# Altium schematic sheet Sheet1.SchDoc
size A0; SheetNumber: 1; SheetTotal: 1
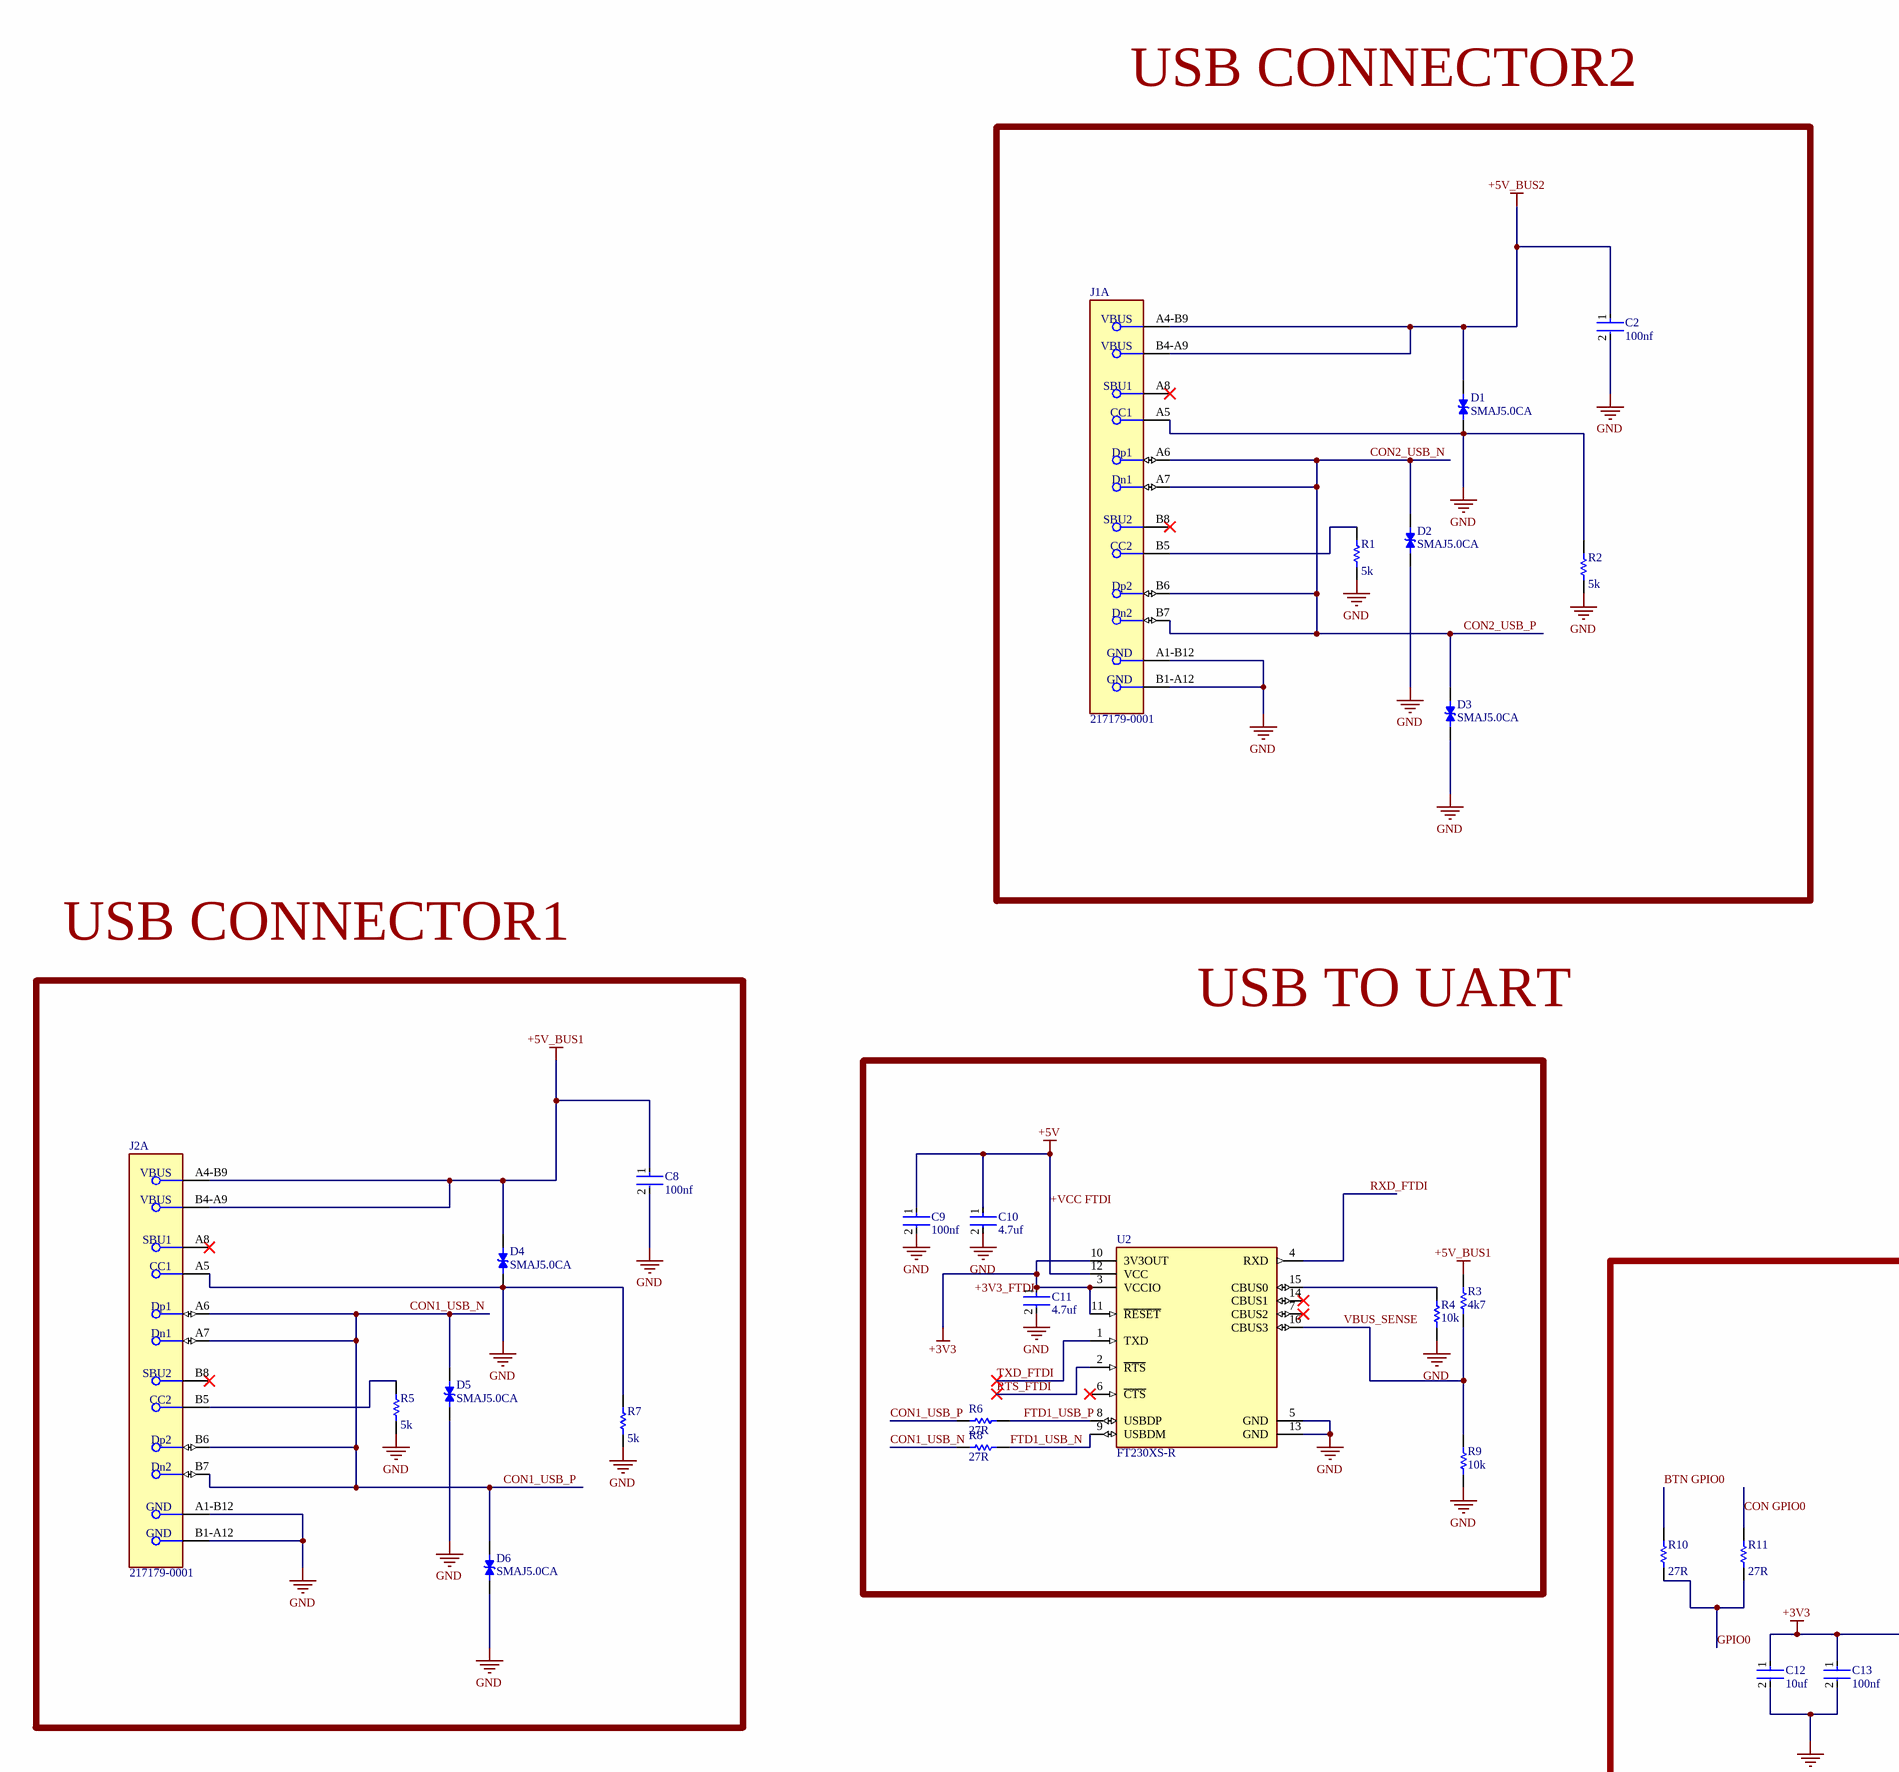
[diagram p0: Sheet1.SchDoc, top left]
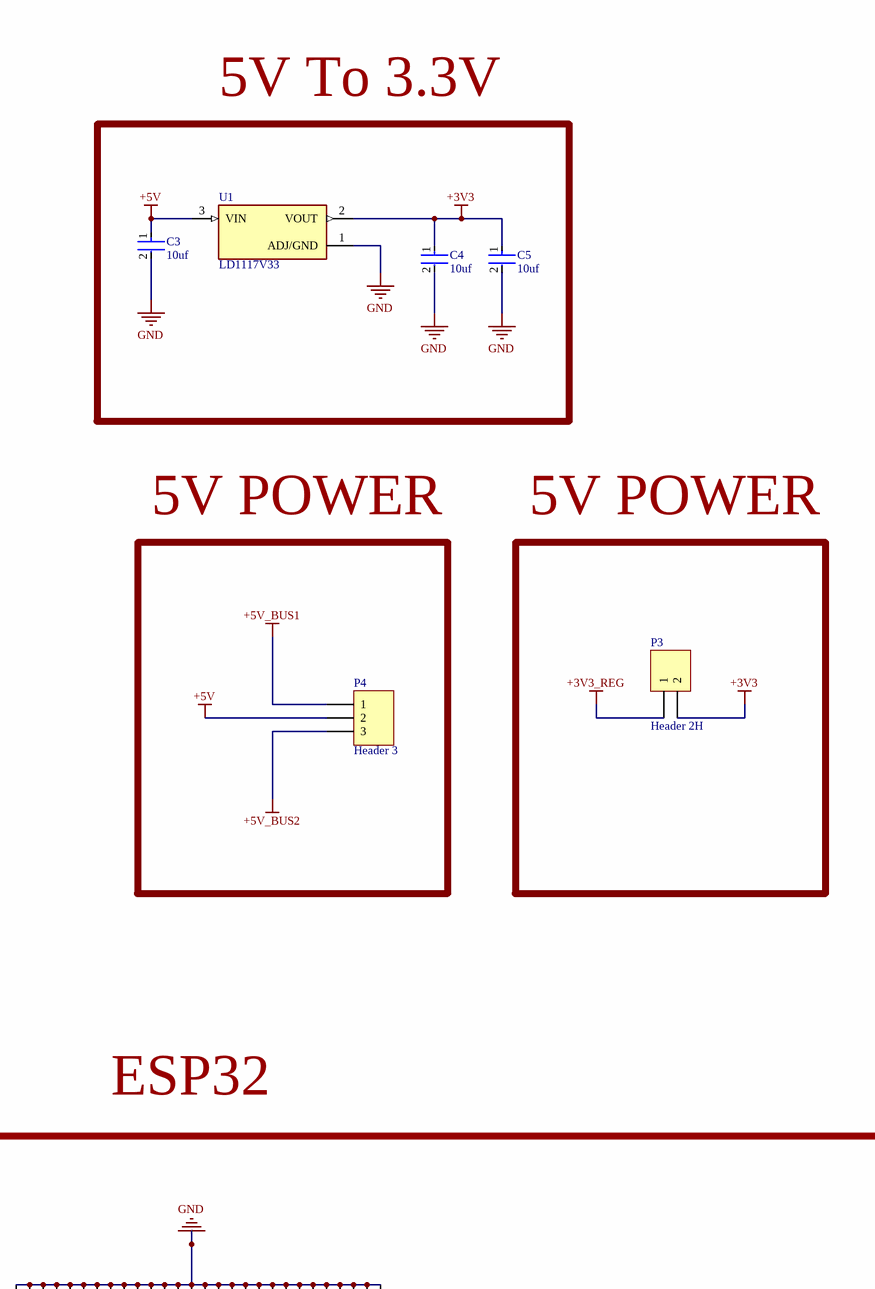
[diagram p1: Sheet1.SchDoc, top middle]
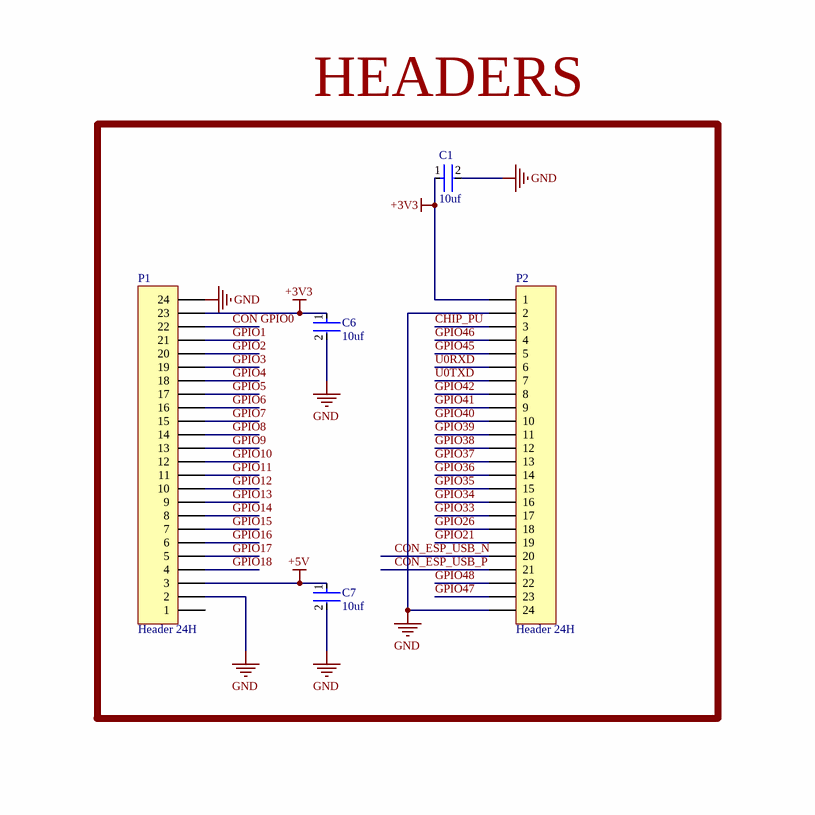
[diagram p2: Sheet1.SchDoc, top right]
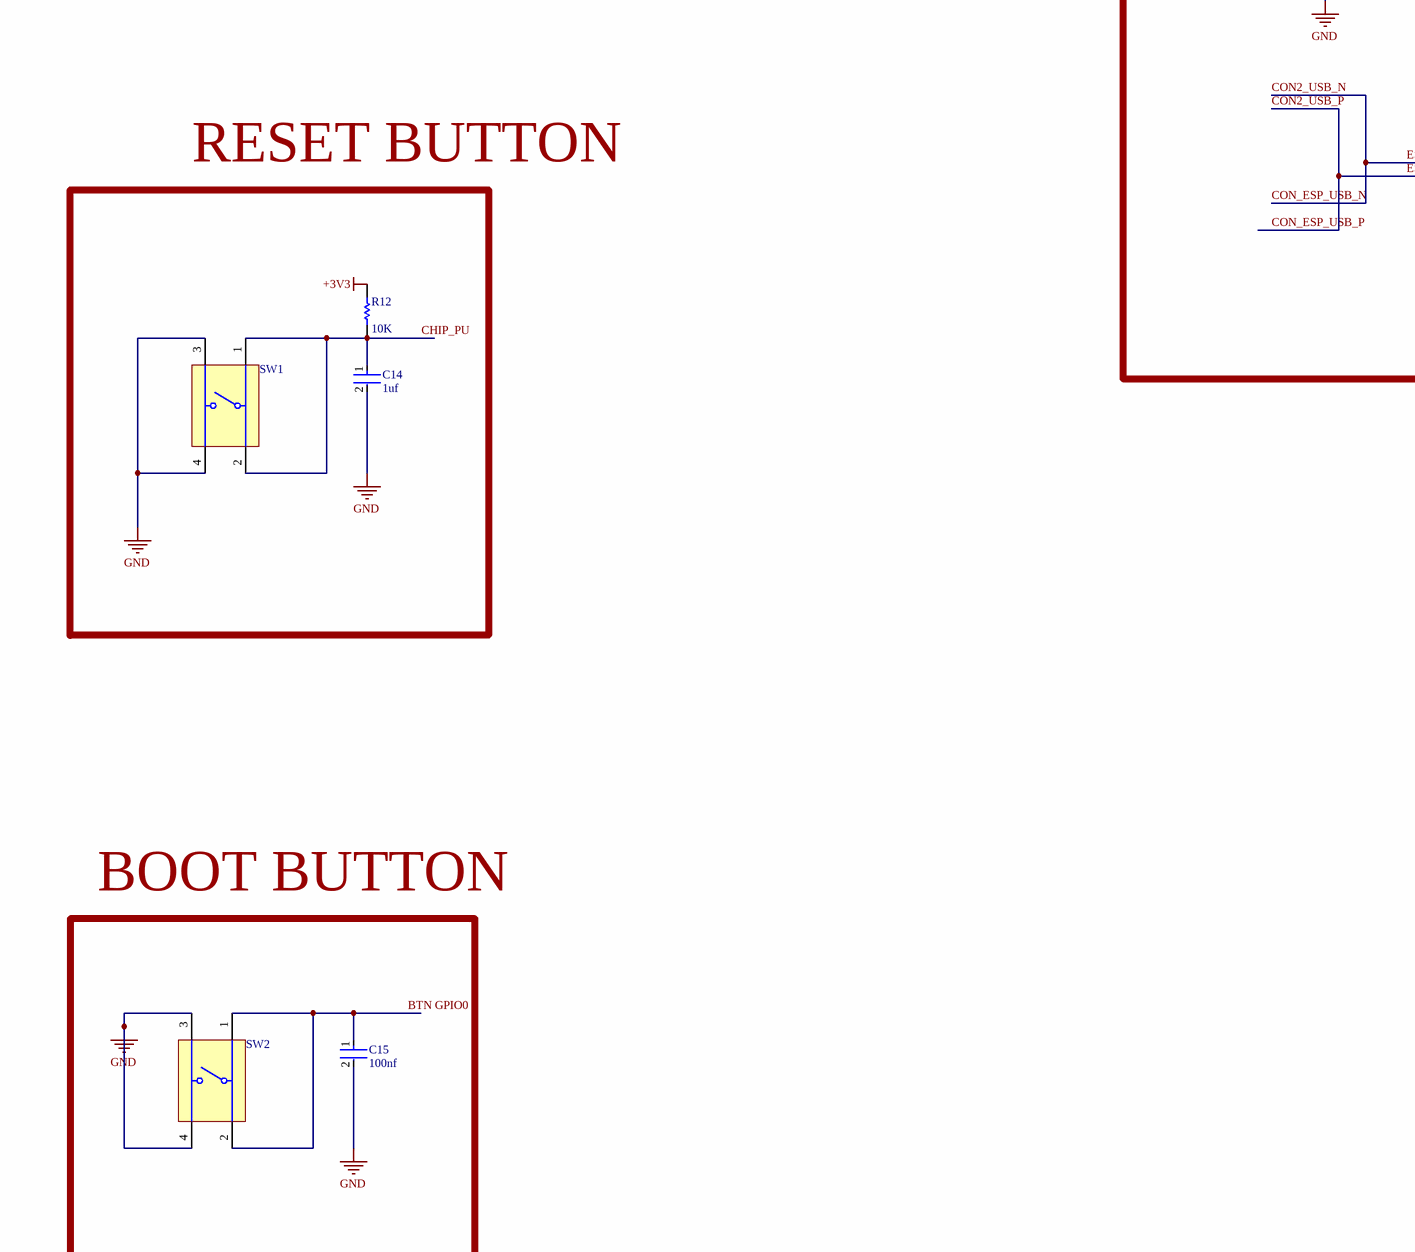
[diagram p3: Sheet1.SchDoc, bottom left]
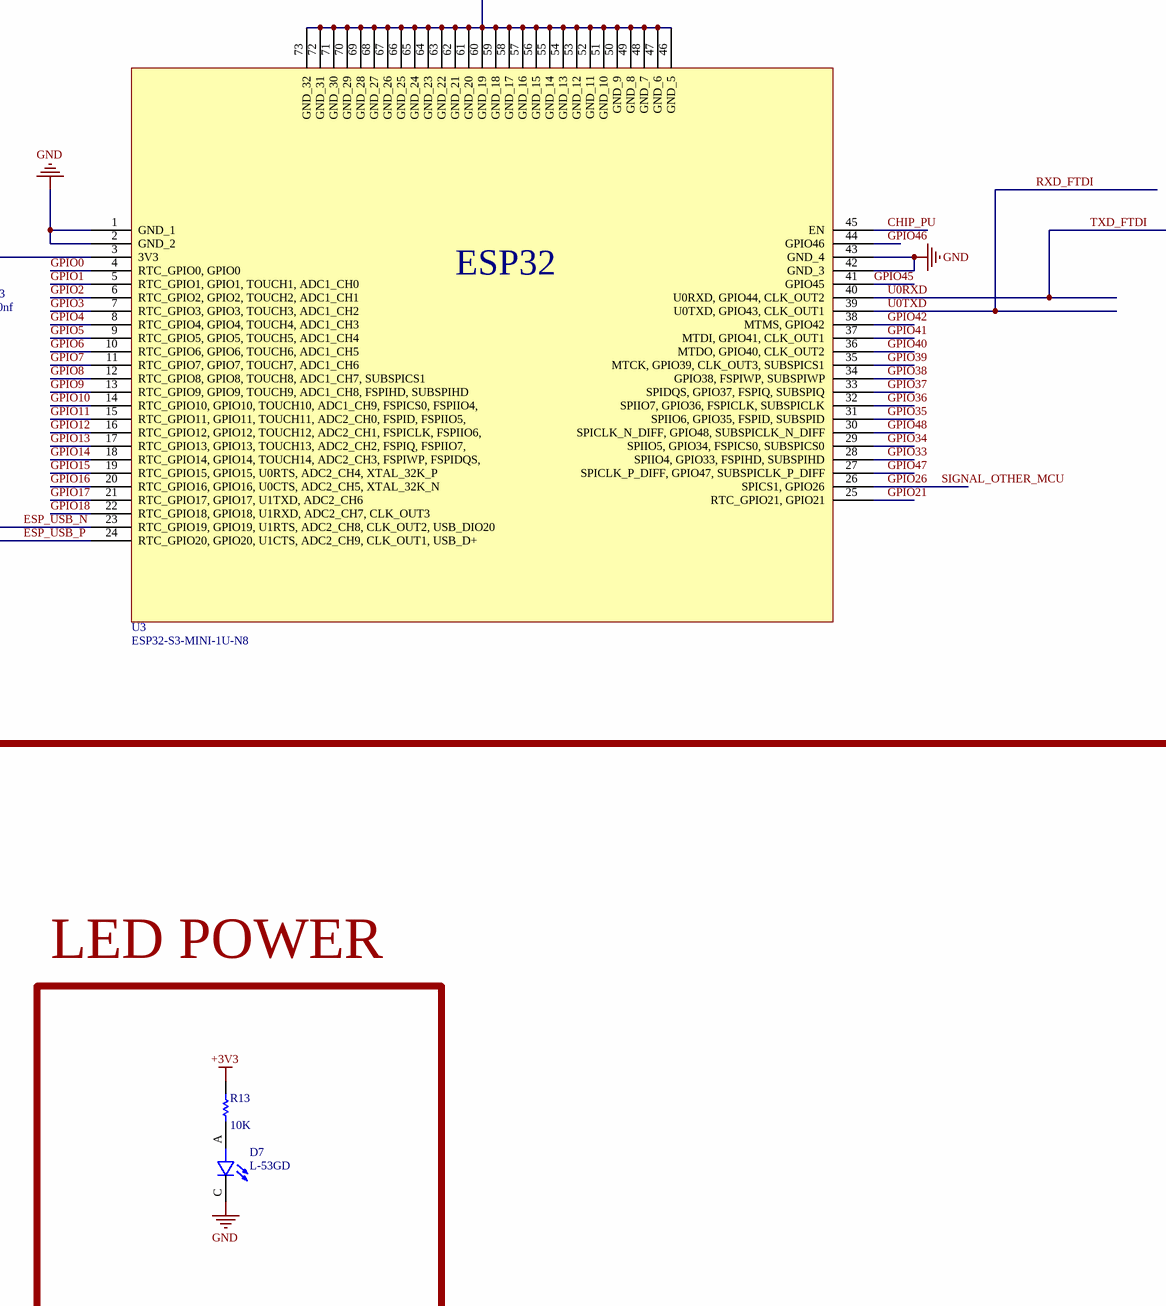
[diagram p4: Sheet1.SchDoc, bottom middle]
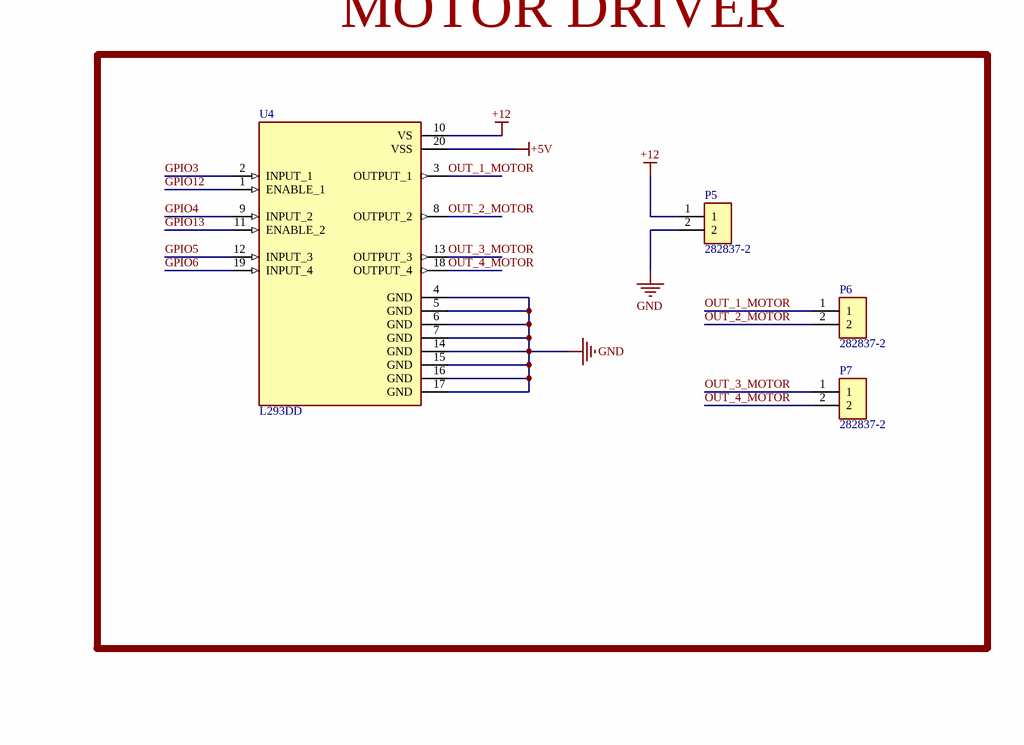
[diagram p5: Sheet1.SchDoc, bottom right]

## Parts
C1  10uf  [FP-CL17-IPC_C]
C2  100nf  [FP-CL17-IPC_C]
C3  10uf  [FP-CL17-IPC_C]
C4  10uf  [FP-CL17-IPC_C]
C5  10uf  [FP-CL17-IPC_C]
C6  10uf  [FP-CL17-IPC_C]
C7  10uf  [FP-CL17-IPC_C]
C8  100nf  [FP-CL17-IPC_C]
C9  100nf  [FP-CL17-IPC_C]
C10  4.7uf  [FP-CL17-IPC_C]
C11  4.7uf  [FP-CL17-IPC_C]
C12  10uf  [FP-CL17-IPC_C]
C13  100nf  [FP-CL17-IPC_C]
C14  1uf  [FP-CL17-IPC_C]
C15  100nf  [FP-CL17-IPC_C]
D1  SMAJ5.0CA  [DIOM4325X250N]
D2  SMAJ5.0CA  [DIOM4325X250N]
D3  SMAJ5.0CA  [DIOM4325X250N]
D4  SMAJ5.0CA  [DIOM4325X250N]
D5  SMAJ5.0CA  [DIOM4325X250N]
D6  SMAJ5.0CA  [DIOM4325X250N]
D7  L-53GD  [LEDRD254W50D500H1060]
J1  217179-0001  [FP-2171790001-MFG]  (part A of 2)
J2  217179-0001  [FP-2171790001-MFG]  (part A of 2)
P1  Header 24H  [HDR1X24H]
P2  Header 24H  [HDR1X24H]
P3  Header 2H  [HDR1X2H]
P4  Header 3  [HDR1X3]
P5  282837-2  [TE_282837-2]
P6  282837-2  [TE_282837-2]
P7  282837-2  [TE_282837-2]
R1  value 5k  [AXIAL-0.3]  (hidden comment: Res1)
R2  value 5k  [AXIAL-0.3]  (hidden comment: Res1)
R3  value 4k7  [AXIAL-0.3]  (hidden comment: Res1)
R4  value 10k  [AXIAL-0.3]  (hidden comment: Res1)
R5  value 5k  [AXIAL-0.3]  (hidden comment: Res1)
R6  value 27R  [AXIAL-0.3]  (hidden comment: Res1)
R7  value 5k  [AXIAL-0.3]  (hidden comment: Res1)
R8  value 27R  [AXIAL-0.3]  (hidden comment: Res1)
R9  value 10k  [AXIAL-0.3]  (hidden comment: Res1)
R10  value 27R  [AXIAL-0.3]  (hidden comment: Res1)
R11  value 27R  [AXIAL-0.3]  (hidden comment: Res1)
R12  value 10K  [AXIAL-0.3]  (hidden comment: Res1)
R13  value 10K  [AXIAL-0.3]  (hidden comment: Res1)
SW1  1825910-6  [TECO-1825910-6_V]  (value not drawn)
SW2  1825910-6  [TECO-1825910-6_V]  (value not drawn)
U1  LD1117V33  [TO255P1020X450X1968-3]
U2  FT230XS-R  [FP-SSOP-16-MFG]
U3  ESP32-S3-MINI-1U-N8  [XCVR_ESP32-S3-MINI-1-N8]
U4  L293DD  [SOIC127P1032X265-20N]

## Blocks framed on the sheet
5V To 3.3V: C3-C5 U1
HEADERS: C1 C6 C7 P1 P2
5V POWER: P4
5V POWER: P3
MOTOR DRIVER: P5-P7 U4
RESET BUTTON: C14 R12 SW1
LED POWER: D7 R13
BOOT BUTTON: C15 SW2

## Nets
+3V3_FTDI: C1.1 C4.1 C5.1 C6.1 C11.1 C12.1 C13.1 P1.23 P2.1 P3.2 R12.2 R13.2 U1.2(VOUT) U2.3(VCCIO) U2.10(3V3OUT) U2.11(~{RESET}) U3.3(3V3)  [also labelled +3V3]
+3V3_REG: P3.1
+5V_BUS1: C8.1 D4.2 J2.A4-B9(VBUS) J2.B4-A9(VBUS) P4.1 R3.2
+5V_BUS2: C2.1 D1.2 J1.A4-B9(VBUS) J1.B4-A9(VBUS) P4.3
+12: P5.1 U4.10(VS)
+VCC FTDI: C3.1 C7.1 C9.1 C10.1 P1.3 P4.2 U1.3(VIN) U2.12(VCC) U4.20(VSS)  [also labelled +5V]
GND: C1.2 C2.2 C3.2 C4.2 C5.2 C6.2 C7.2 C8.2 C9.2 C10.2 C11.2 C12.2 C13.2 C14.2 C15.2 D1.1 D2.1 D3.1 D4.1 D5.1 D6.1 D7.C J1.A1-B12(GND) J1.A5(CC1) J1.B1-A12(GND) J2.A1-B12(GND) J2.A5(CC1) J2.B1-A12(GND) P1.2 P1.24 P2.2 P2.24 P5.2 R1.1 R2.1 R2.2 R4.1 R5.1 R7.1 R7.2 R9.1 SW1.3 SW1.4 SW2.3 SW2.4 U1.1(ADJ/GND) U2.5(GND) U2.13(GND) U3.1(GND_1) U3.2(GND_2) U3.42(GND_3) U3.43(GND_4) U3.46(GND_5) U3.47(GND_6) U3.48(GND_7) U3.49(GND_8) U3.50(GND_9) U3.51(GND_10) U3.52(GND_11) U3.53(GND_12) U3.54(GND_13) U3.55(GND_14) U3.56(GND_15) U3.57(GND_16) U3.58(GND_17) U3.59(GND_18) U3.60(GND_19) U3.61(GND_20) U3.62(GND_21) U3.63(GND_22) U3.64(GND_23) U3.65(GND_24) U3.66(GND_25) U3.67(GND_26) U3.68(GND_27) U3.69(GND_28) U3.70(GND_29) U3.71(GND_30) U3.72(GND_31) U3.73(GND_32) U4.4(GND) U4.5(GND) U4.6(GND) U4.7(GND) U4.14(GND) U4.15(GND) U4.16(GND) U4.17(GND)
BTN GPIO0: C15.1 R10.2 SW2.1 SW2.2
CHIP_PU: C14.1 P2.3 R12.1 SW1.1 SW1.2 U3.45(EN)
CON1_USB_N: D5.2 D6.2 J2.A6(Dp1) J2.A7(Dn1) J2.B6(Dp2) J2.B7(Dn2) R6.1 R8.2  [also labelled CON1_USB_P]
CON2_USB_N: D2.2 D3.2 J1.A6(Dp1) J1.A7(Dn1) J1.B6(Dp2) J1.B7(Dn2) P2.20 P2.21 U3.23(RTC_GPIO19,_GPIO19,_U1RTS,_ADC2_CH8,_CLK_OUT2,_USB_DIO20) U3.24(RTC_GPIO20,_GPIO20,_U1CTS,_ADC2_CH9,_CLK_OUT1,_USB_D+)  [also labelled CON2_USB_P, CON_ESP_USB_N, CON_ESP_USB_P, ESP_USB_N, ESP_USB_P]
CON GPIO0: P1.22 R11.2
FTD1_USB_N: R8.1 U2.9(USBDM)
FTD1_USB_P: R6.2 U2.8(USBDP)
GPIO0: R10.1 R11.1 U3.4(RTC_GPIO0,_GPIO0)
GPIO1: P1.21 U3.5(RTC_GPIO1,_GPIO1,_TOUCH1,_ADC1_CH0)
GPIO2: P1.20 U3.6(RTC_GPIO2,_GPIO2,_TOUCH2,_ADC1_CH1)
GPIO3: P1.19 U3.7(RTC_GPIO3,_GPIO3,_TOUCH3,_ADC1_CH2) U4.2(INPUT_1)
GPIO4: P1.18 U3.8(RTC_GPIO4,_GPIO4,_TOUCH4,_ADC1_CH3) U4.9(INPUT_2)
GPIO5: P1.17 U3.9(RTC_GPIO5,_GPIO5,_TOUCH5,_ADC1_CH4) U4.12(INPUT_3)
GPIO6: P1.16 U3.10(RTC_GPIO6,_GPIO6,_TOUCH6,_ADC1_CH5) U4.19(INPUT_4)
GPIO7: P1.15 U3.11(RTC_GPIO7,_GPIO7,_TOUCH7,_ADC1_CH6)
GPIO8: P1.14 U3.12(RTC_GPIO8,_GPIO8,_TOUCH8,_ADC1_CH7,_SUBSPICS1)
GPIO9: P1.13 U3.13(RTC_GPIO9,_GPIO9,_TOUCH9,_ADC1_CH8,_FSPIHD,_SUBSPIHD)
GPIO10: P1.12 U3.14(RTC_GPIO10,_GPIO10,_TOUCH10,_ADC1_CH9,_FSPICS0,_FSPIIO4,)
GPIO11: P1.11 U3.15(RTC_GPIO11,_GPIO11,_TOUCH11,_ADC2_CH0,_FSPID,_FSPIIO5,)
GPIO12: P1.10 U3.16(RTC_GPIO12,_GPIO12,_TOUCH12,_ADC2_CH1,_FSPICLK,_FSPIIO6,) U4.1(ENABLE_1)
GPIO13: P1.9 U3.17(RTC_GPIO13,_GPIO13,_TOUCH13,_ADC2_CH2,_FSPIQ,_FSPIIO7,) U4.11(ENABLE_2)
GPIO14: P1.8 U3.18(RTC_GPIO14,_GPIO14,_TOUCH14,_ADC2_CH3,_FSPIWP,_FSPIDQS,)
GPIO15: P1.7 U3.19(RTC_GPIO15,_GPIO15,_U0RTS,_ADC2_CH4,_XTAL_32K_P)
GPIO16: P1.6 U3.20(RTC_GPIO16,_GPIO16,_U0CTS,_ADC2_CH5,_XTAL_32K_N)
GPIO17: P1.5 U3.21(RTC_GPIO17,_GPIO17,_U1TXD,_ADC2_CH6)
GPIO18: P1.4 U3.22(RTC_GPIO18,_GPIO18,_U1RXD,_ADC2_CH7,_CLK_OUT3)
GPIO21: P2.19 U3.25(RTC_GPIO21,_GPIO21)
GPIO26: P2.18 U3.26(SPICS1,_GPIO26)  [also labelled SIGNAL_OTHER_MCU]
GPIO33: P2.17 U3.28(SPIIO4,_GPIO33,_FSPIHD,_SUBSPIHD)
GPIO34: P2.16 U3.29(SPIIO5,_GPIO34,_FSPICS0,_SUBSPICS0)
GPIO35: P2.15 U3.31(SPIIO6,_GPIO35,_FSPID,_SUBSPID)
GPIO36: P2.14 U3.32(SPIIO7,_GPIO36,_FSPICLK,_SUBSPICLK)
GPIO37: P2.13 U3.33(SPIDQS,_GPIO37,_FSPIQ,_SUBSPIQ)
GPIO38: P2.12 U3.34(GPIO38,_FSPIWP,_SUBSPIWP)
GPIO39: P2.11 U3.35(MTCK,_GPIO39,_CLK_OUT3,_SUBSPICS1)
GPIO40: P2.10 U3.36(MTDO,_GPIO40,_CLK_OUT2)
GPIO41: P2.9 U3.37(MTDI,_GPIO41,_CLK_OUT1)
GPIO42: P2.8 U3.38(MTMS,_GPIO42)
GPIO45: P2.5 U3.41(GPIO45)
GPIO46: P2.4 U3.44(GPIO46)
GPIO47: P2.23 U3.27(SPICLK_P_DIFF,_GPIO47,_SUBSPICLK_P_DIFF)
GPIO48: P2.22 U3.30(SPICLK_N_DIFF,_GPIO48,_SUBSPICLK_N_DIFF)
OUT_1_MOTOR: P6.1 U4.3(OUTPUT_1)
OUT_2_MOTOR: P6.2 U4.8(OUTPUT_2)
OUT_3_MOTOR: P7.1 U4.13(OUTPUT_3)
OUT_4_MOTOR: P7.2 U4.18(OUTPUT_4)
RTS_FTDI: U2.2(~{RTS})
RXD_FTDI: P2.7 U2.4(RXD) U3.39(U0TXD,_GPIO43,_CLK_OUT1)  [also labelled U0TXD]
TXD_FTDI: P2.6 U2.1(TXD) U3.40(U0RXD,_GPIO44,_CLK_OUT2)  [also labelled U0RXD]
VBUS_SENSE: R3.1 R9.2 U2.16(CBUS3)
NetD7_A: D7.A R13.1
NetJ1_B5: J1.B5(CC2) R1.2
NetJ2_B5: J2.B5(CC2) R5.2
NetR4_2: R4.2 U2.15(CBUS0)

Not connected (* = marked no-connect by the designer): J1 A8(SBU1)* B8(SBU2)*; J2 A8(SBU1)* B8(SBU2)*; P1 1; U2 6(~{CTS})* 7(CBUS2)* 14(CBUS1)*

## Notes on the sheet
- USB CONNECTOR2
- USB CONNECTOR1
- USB TO UART
- ESP32
- (in symbol ESP32-S3-MINI-1U-N8) ESP32

## Library data of the parts
C1-C15 = CMP-13271-001069-1: Cap Ceramic 100nF 10V X7R ±10% SMD 0402 +125°C Paper T/R; Height: 0.5mm; Case/Package: 0402; Contact Plating: Tin; Case Code (Imperial): 0402; Capacitance: 100nF; Thickness: 0.022inch; Min Operating Temperature: -55°C; Package Quantity: 1; Length: 1mm; Max Operating Temperature: 125°C; Depth: 0.5mm; Voltage Rating: 10V; Packaging: Tape and Reel; Mount: Surface Mount; Tolerance: 10%; Width: 0.02inch; Radiation Hardening: No; Case Code (Metric): 1005; Dielectric: X7R
D7 = L-53GD: LED 5mm Green 568nm 20mcd/10mA 60Â°; MF: Kingbright; Value: *; Package: CDIP-28; Check_prices: https://www.snapeda.com/parts/L-53GD/Kingbright/view-part/?ref=eda; MP: L-53GD; Price: None; SnapEDA_Link: https://www.snapeda.com/parts/L-53GD/Kingbright/view-part/?ref=snap; Availability: Unavailable
J1 J2 = CMP-04767-000028-2: CONN RCP USB2.0 TYP C 24P SMD RA; NexarPartId: 117190526; Gender: Receptacle; Number of Contacts: 16; Current Rating: 1.25A; Voltage Rating: 30V; Min Operating Temperature: -40°C; USB Standard: USB 2.0; Height: 3.36mm; Contact Material: Gold, Nickel; Max Operating Temperature: 85°C
P1 P2 = Header 24H: Header, 24-Pin, Right Angle; LatestRevisionDate: 17-Jul-2002; LatestRevisionNote: Re-released for DXP Platform.; Publisher: Altium Limited
P3 = Header 2H: Header, 2-Pin, Right Angle; LatestRevisionDate: 17-Jul-2002; LatestRevisionNote: Re-released for DXP Platform.; Publisher: Altium Limited
P4 = Header 3: Header, 3-Pin; LatestRevisionDate: 17-Jul-2002; LatestRevisionNote: Re-released for DXP Platform.; Publisher: Altium Limited
P5-P7 = 282837-2: Ð Ð°Ð·ÑŠÐµÐ¼Ð½Ñ‹Ðµ ÐºÐ»ÐµÐ¼Ð¼Ð½Ñ‹Ðµ ÐºÐ¾Ð»Ð¾Ð´ÐºÐ¸ Ð Ð¾Ð·ÐµÑ‚ÐºÐ° 2 Ð¿Ð¾Ð»Ð¾Ð¶ÐµÐ½Ð¸Ñ 5,08 Ð¼Ð¼ ÐŸÑ€Ð¸Ð¿Ð¾Ð¹ Ð¿Ñ€ÑÐ¼Ð¾Ð¹ Ñ‡ÐµÑ€ÐµÐ· Ð¾Ñ‚Ð²ÐµÑ€ÑÑ‚Ð¸Ðµ 13,5 Ð / ÐºÐ¾Ð½Ñ‚Ð°ÐºÑ‚; MF: TE Connectivity; SnapEDA_Link: https://www.snapeda.com/parts/282837-2/TE+Connectivity+AMP+Connectors/view-part/?ref=snap; Price: None; Check_prices: https://www.snapeda.com/parts/282837-2/TE+Connectivity+AMP+Connectors/view-part/?ref=eda; Purchase-URL: https://pricing.snapeda.com/search/part/282837-2/?ref=eda; MP: 282837-2; Value: *; Availability: In Stock; Package: None
R1-R13 = Res1: Resistor; Published: 8-Jun-2000; LatestRevisionDate: 17-Jul-2002; LatestRevisionNote: Re-released for DXP Platform.; PackageReference: AXIAL-0.3; Publisher: Altium Limited; PackageDescription: Axial Device, Thru-Hole; 2 Leads; 0.3 in Pin Spacing
SW1 SW2 = CMP-1684-00021-1: Tact Switch, SPST-NO, 0.05 A, -35 to 85 degC, 4-Pin THD, RoHS, Bulk; Manufacturer: TE Connectivity; Maximum Contact Resistance: 100mOhm; Mechanical Life: 100000Cycles; Bushing Type: Unthreaded; Switch Configuration: OFF(ON); Maximum DC Voltage Rating: 24V; Contact Rating @ Voltage: 0.05A@24VDC; Actuator Color: Black; Body Orientation: Straight; Function: MomentaryContact; Illumination: N/R; Actuator Style: RoundButton; Actuator Material: PolybutyleneTerephthalate; Dielectric Strength: 500VAC; Pole Throw Configuration: SPST; Actuator Length: 1.4mm; Product Weight: N/A; Contact Material: CopperAlloy; Housing Material: N/A; Terminal Type: PCPins; Minimum Insulation Resistance: 100MOhm; Package Description: 4-Pin Through Hole Device, Body 5.99 x 5.99 mm, Pitch 6.5 mm; Part No: 1825910-6; Package Reference: THD; Base Material: N/A; Manufacturer URL: http://www.te.com; Contact Plating: Silver; RoHS: Yes; Datasheet Version: Rev. C9; Electrical Life: 100000Cycles; Maximum AC Voltage Rating: N/A; Thread Size: N/R; Operating Temperature: -35to85C; Mounting: ThroughHole; Dimension: 5.99x5mm; Datasheet URL: http://www.te.com/commerce/DocumentDelivery/DDEController?Action=showdoc&DocId=Customer+Drawing%7F1825910%7FC9%7Fpdf%7FEnglish%7FENG_CD_1825910_C9.pdf%7F1825910-6; Family: 1825910; Seal Location: N/A; Seal Description: N/A; Packaging: N/A
U1 = LD1117V33: Linear Voltage Regulator IC Positive Fixed 1 Output 800mA TO-220AB; MF: STMicroelectronics; SnapEDA_Link: https://www.snapeda.com/parts/LD1117V33/STMicroelectronics/view-part/?ref=snap; Package: TO-220-3 ON Semiconductor; MP: LD1117V33; Check_prices: https://www.snapeda.com/parts/LD1117V33/STMicroelectronics/view-part/?ref=eda; Purchase-URL: https://pricing.snapeda.com/search/part/LD1117V33/?ref=eda; Price: None; Value: *; Availability: In Stock
U2 = CMP-0248-00026-3: IC USB SERIAL BASIC UART 16SSOP; Min Supply Voltage: 2.97V; Data Rate: 12Mbps; Operating Supply Voltage: 5V; Number of Channels: 1; Max Supply Voltage: 5.5V; Operating Supply Current: 8mA; Case/Package: SSOP; Length: 5mm; Interface: UART; Mount: Surface Mount; Number of Pins: 16; Packaging: Tape and Reel; Weight: 0.004586oz; Min Operating Temperature: -40°C; Width: 0.157inch; Height: 0.059inch; Package Quantity: 3000; Max Operating Temperature: 85°C
U3 = ESP32-S3-MINI-1U-N8: Manufacturer: Espressif Systems; Supplier: Digikey; Supplier Part Number: 1965-ESP32-S3-MINI-1U-N8CT-ND; Manufacturer Part Number: ESP32-S3-MINI-1U-N8; RoHS: No; Category: LDO; Stock: 2332; Pricing: 1=3.1 (USD)
U4 = L293DD: Bipolar Motor Driver Parallel 20-SOIC; MF: STMicroelectronics; Package: SOIC-20 STMicroelectronics; SnapEDA_Link: https://www.snapeda.com/parts/L293DD/STMicroelectronics/view-part/585585/?ref=snap; MP: L293DD; Value: *; Availability: Unavailable; Price: None
D1-D6 = SMAJ5.0CA: Availability: Unavailable; Price: None; Package: None; Value: *; MP: SMAJ5.0CA